# EAGLE design POV_RGB (EAGLE 7.2.0)
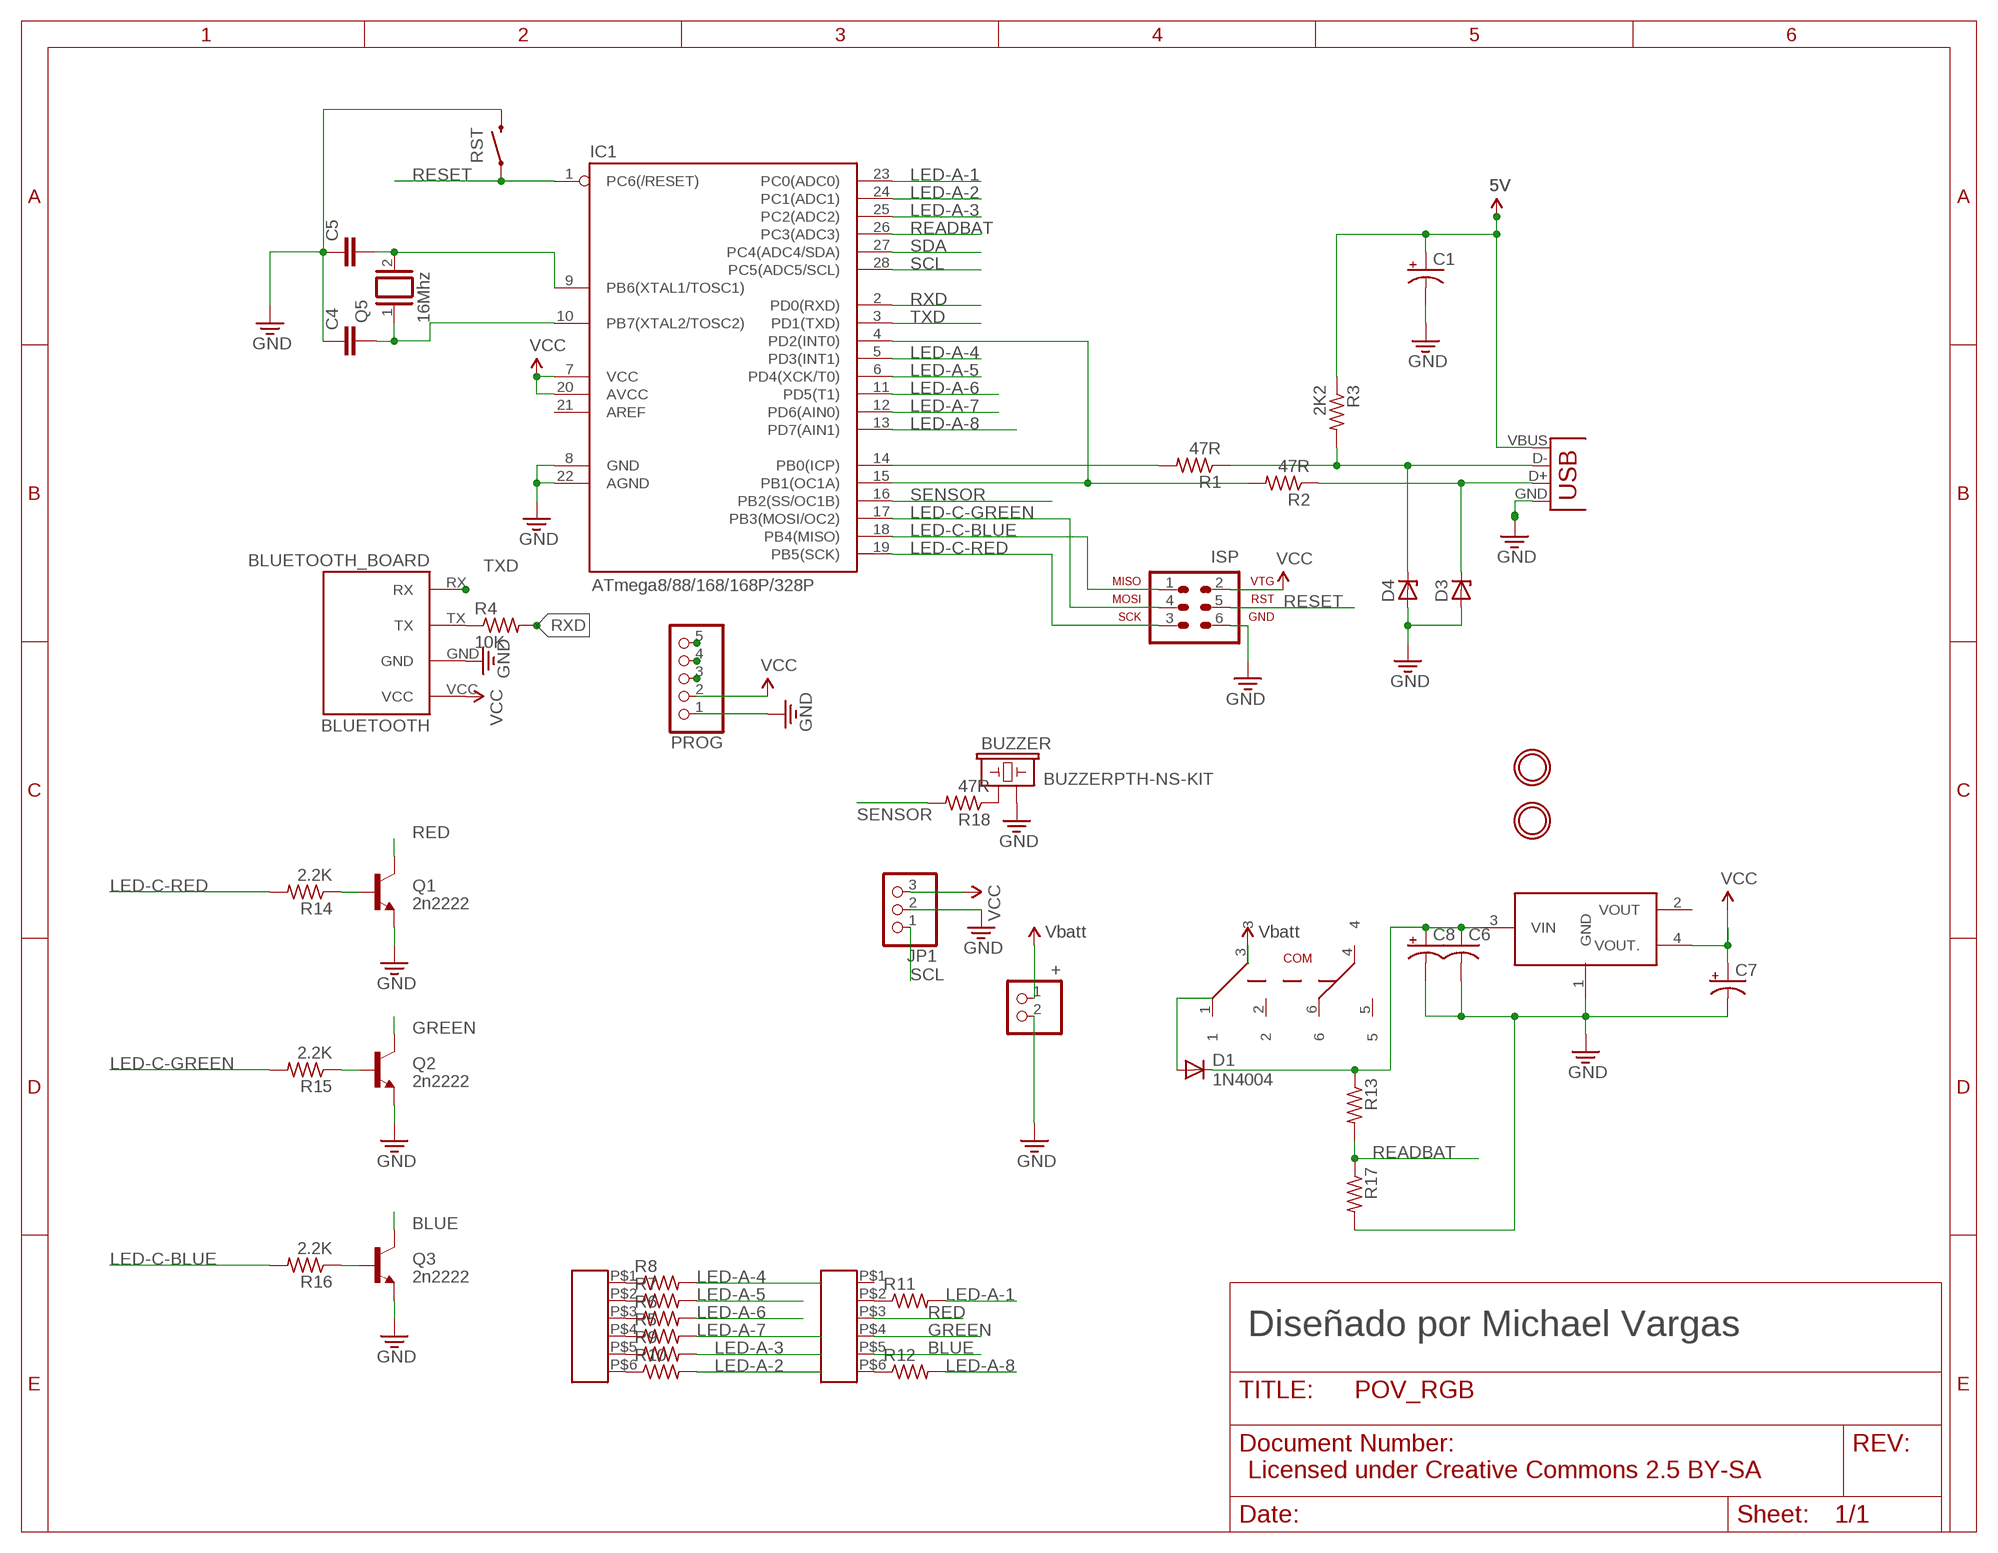
[diagram p0: schematic, sheet 1]

## Parts
5V  LD1117S50TR  [SOT223]
+  HEADER-1X2  [1X02_OVAL]
BLUETOOTH  BLUETOOTH_BOARD  [BT_BOARD_FOOTPRINT]
BUZZER  BUZZERPTH-NS-KIT  [BUZZER-12MM-NS-KIT]
C1  CPOL-USD  [PANASONIC_D]
C4  CAPPTH2  [CAP-PTH-SMALL2]
C5  CAPPTH2  [CAP-PTH-SMALL2]
C6  C-USC1206  [C1206]
C7  CPOL-USD  [PANASONIC_D]
C8  CPOL-USD  [PANASONIC_D]
D1  1N4004  [DO41-10]
D3  ZENER-DIODEDO34-7  [DO34Z7]
D4  ZENER-DIODEDO34-7  [DO34Z7]
IC1  ATmega8/88/168/168P/328P  AVR-MEGA8-PPTH  [DIL28-3]
ISP  AVR-ISP-6  [AVR-ISP-6]
JP1  PINHD-1X3  [1X03]
PROG  PINHD-1X5  [1X05]
Q1  2n2222  TRANSISTOR_NPNTO-92-AMMO  [TO-92-AMMO]
Q2  2n2222  TRANSISTOR_NPNTO-92-AMMO  [TO-92-AMMO]
Q3  2n2222  TRANSISTOR_NPNTO-92-AMMO  [TO-92-AMMO]
Q5  16Mhz  XTAL/S  [QS]
R1  47R  R-US_0207/9  [0207/9]
R2  47R  R-US_0207/9  [0207/9]
R3  2K2  R-US_0207/9  [0207/9]
R4  10K  R-US_R0805  [R0805]
R5  R-US_R0805  [R0805]
R6  R-US_R0805  [R0805]
R7  R-US_R0805  [R0805]
R8  R-US_R0805  [R0805]
R9  R-US_R0805  [R0805]
R10  R-US_R0805  [R0805]
R11  R-US_R0805  [R0805]
R12  R-US_R0805  [R0805]
R13  R-US_R0805  [R0805]
R14  2.2K  R-US_R0805  [R0805]
R15  2.2K  R-US_R0805  [R0805]
R16  2.2K  R-US_R0805  [R0805]
R17  R-US_R0805  [R0805]
R18  47R  R-US_R0805  [R0805]
RST  SWITCH-MOMENTARY-2SMD-1101NE  [TACTILE-SWITCH-1101NE]
U$2  MOUNTINGHOLE2.5_THICK  [MOUNTINGHOLE_2.5_PLATED_THICK]
U$3  SMD_HEADER6  [SMD_HEADER6]
U$4  MOUNTINGHOLE2.5_THICK  [MOUNTINGHOLE_2.5_PLATED_THICK]
U$5  SMD_HEADER6  [SMD_HEADER6]
U$6  TL2285  [TL2285]
USB  USBPTH  [USB-B-PTH]

## Nets
3.3V: +.1 U$6.3 ; supply symbol labelled Vbatt
5V: C1.+ R3.1 USB.VBUS
BLUE: Q3.3(C) U$5.P$5
GND: 5V.1(GND) +.2 BLUETOOTH.GND BUZZER.- C1.- C4.1 C5.1 C6.2 C7.- C8.- D3.A D4.A IC1.8(GND) IC1.22(AGND) ISP.6(GND) JP1.2 PROG.1 Q1.1(E) Q2.1(E) Q3.1(E) R17.2 RST.2 USB.GND USB.S1 USB.S2
GREEN: Q2.3(C) U$5.P$4
LED-A-1: IC1.23(PC0(ADC0)) R11.2
LED-A-2: IC1.24(PC1(ADC1)) R10.2
LED-A-3: IC1.25(PC2(ADC2)) R9.2
LED-A-4: IC1.5(PD3(INT1)) R8.2
LED-A-5: IC1.6(PD4(XCK/T0)) R7.2
LED-A-6: IC1.11(PD5(T1)) R6.2
LED-A-7: IC1.12(PD6(AIN0)) R5.2
LED-A-8: IC1.13(PD7(AIN1)) R12.2
LED-C-BLUE: IC1.18(PB4(MISO)) ISP.1(MISO) R16.2
LED-C-GREEN: IC1.17(PB3(MOSI/OC2)) ISP.4(MOSI) R15.2
LED-C-RED: IC1.19(PB5(SCK)) ISP.3(SCK) R14.2
N$1: R5.1 U$3.P$4
N$2: 5V.3(VIN) C6.1 C8.+ D1.C R13.1
N$3: D4.C R1.1 R3.2 USB.D-
N$4: D3.C R2.1 USB.D+
N$5: R6.1 U$3.P$3
N$6: R7.1 U$3.P$2
N$7: IC1.14(PB0(ICP)) R1.2
N$8: IC1.4(PD2(INT0)) IC1.15(PB1(OC1A)) R2.2
N$9: C5.2 IC1.9(PB6(XTAL1/TOSC1)) Q5.2
N$10: R8.1 U$3.P$1
N$11: R9.1 U$3.P$5
N$12: R10.1 U$3.P$6
N$13: R11.1 U$5.P$2
N$14: R12.1 U$5.P$6
N$15: BUZZER.+ R18.1
N$19: Q1.2(B) R14.1
N$20: Q2.2(B) R15.1
N$21: Q3.2(B) R16.1
N$22: C4.2 IC1.10(PB7(XTAL2/TOSC2)) Q5.1
N$23: D1.A U$6.1
N$24: BLUETOOTH.TX R4.1
READBAT: IC1.26(PC3(ADC3)) R13.2 R17.1
RED: Q1.3(C) U$5.P$3
RESET: IC1.1(PC6(/RESET)) ISP.5(RST) PROG.5 RST.1
RXD: IC1.2(PD0(RXD)) PROG.4 R4.2
SCL: IC1.28(PC5(ADC5/SCL)) JP1.1
SDA: IC1.27(PC4(ADC4/SDA))
SENSOR: IC1.16(PB2(SS/OC1B)) R18.2
TXD: BLUETOOTH.RX IC1.3(PD1(TXD)) PROG.3
VCC: 5V.4(VOUT.) BLUETOOTH.VCC C7.+ IC1.7(VCC) IC1.20(AVCC) ISP.2(VTG) JP1.3 PROG.2
Unconnected: 5V.2(VOUT) IC1.21(AREF) U$5.P$1 U$6.2 U$6.4 U$6.5 U$6.6

## Notes on the sheet
- Diseñado por Michael Vargas
- Licensed under Creative Commons 2.5 BY-SA

## Library data of the parts
5V = v-reg:LD1117S50TR
+ = microbuilder:HEADER-1X2: PIN HEADER
BLUETOOTH = HC-05:BLUETOOTH_BOARD: Bluetooth Board V1.05
BUZZER = SparkFun-Electromechanical:BUZZER: Buzzer 12mm Spark Fun Electronics SKU : Comp-Buzzer; PROD_ID: COMP-08253
C1 C7 C8 = adafruit:CPOL-US: POLARIZED CAPACITOR, American symbol
C4 C5 = SparkFun-Passives:CAP: Capacitor Standard 0603 ceramic capacitor, and 0.1" leaded capacitor.
C6 = adafruit:C-US: CAPACITOR, American symbol
D1 = adafruit:1N4004: DIODE General purpose 1N400x type rectifier (With bigger pads) http://www.ladyada.net/library/pcb/eaglelibrary.html
D3 D4 = diode:ZENER-DIODE: Z-Diode
IC1 = minipov4:AVR-MEGA8-P: MICROCONTROLLER 8 Kbytes FLASH 1 kbytes SRAM 512 bytes EEPROM USART 4-channel 10 bit ADC 2-channel 8 bit ADC
ISP = minipov4:AVR-ISP-6: AVR ISP-6 Serial Programming Header
JP1 = pinhead:PINHD-1X3: PIN HEADER
PROG = pinhead:PINHD-1X5: PIN HEADER
Q1-Q3 = SparkFun-DiscreteSemi:TRANSISTOR_NPN: Generic NPN BJT MMBT2222A - TRANS-08049 (SOT-23, 1A 40V) MPSA42 - TRANS-09116 (SOT-23, 500mA 300V) MMBT5088LT1G - TRANS-11160 (SOT-23, 50 mA 30V) BC547 - COM-08928 <http://www.sparkfun.com/products/8928> (TO-92 45V 100mA) (1.Collector 2.Base 3.Emitter) 2N3904 - COM-00521 <http://www.sparkfun.com/products/521> (TO-92 40V 200mA) (1.Emitter 2.Base 3.Collector) P2N2222A - COM-12852 <http://www.sparkfun.com/products/12852> (TO-92 40V 600mA) (1.Collector 2.Base 3.Emitter)
Q5 = special:XTAL/S: CRYSTAL
R1-R3 = adafruit:R-US_: RESISTOR, American symbol
R4-R18 = resistor:R-US_: RESISTOR, American symbol
RST = SparkFun-Electromechanical:SWITCH-MOMENTARY-2: Various NO switches- pushbuttons, reed, etc; PROD_ID: SWCH-00815
U$2 U$4 = microbuilder:MOUNTINGHOLE: Mounting Hole For #2 screws (0.086"/2.18mm width, 0.094"/2.4mm hole) use 2.5mm
U$3 U$5 = SMD_HEADER10:SMD_HEADER6
U$6 = E-SWITCH_6PIN:TL2285
USB = minipov4:USB: USB Connectors USB-B-PTH is fully proven SKU : PRT-00139 USB-miniB is fully proven SKU : PRT-00587 USB-A-PCB is untested. USB-A-H is throughly reviewed, but untested. Spark Fun Electronics SKU : PRT-00437 USB-B-SMT is throughly reviewed, but untested. Needs silkscreen touching up. USB-A-S has not been used/tested USB-MB-H has not been used/tested

## Board
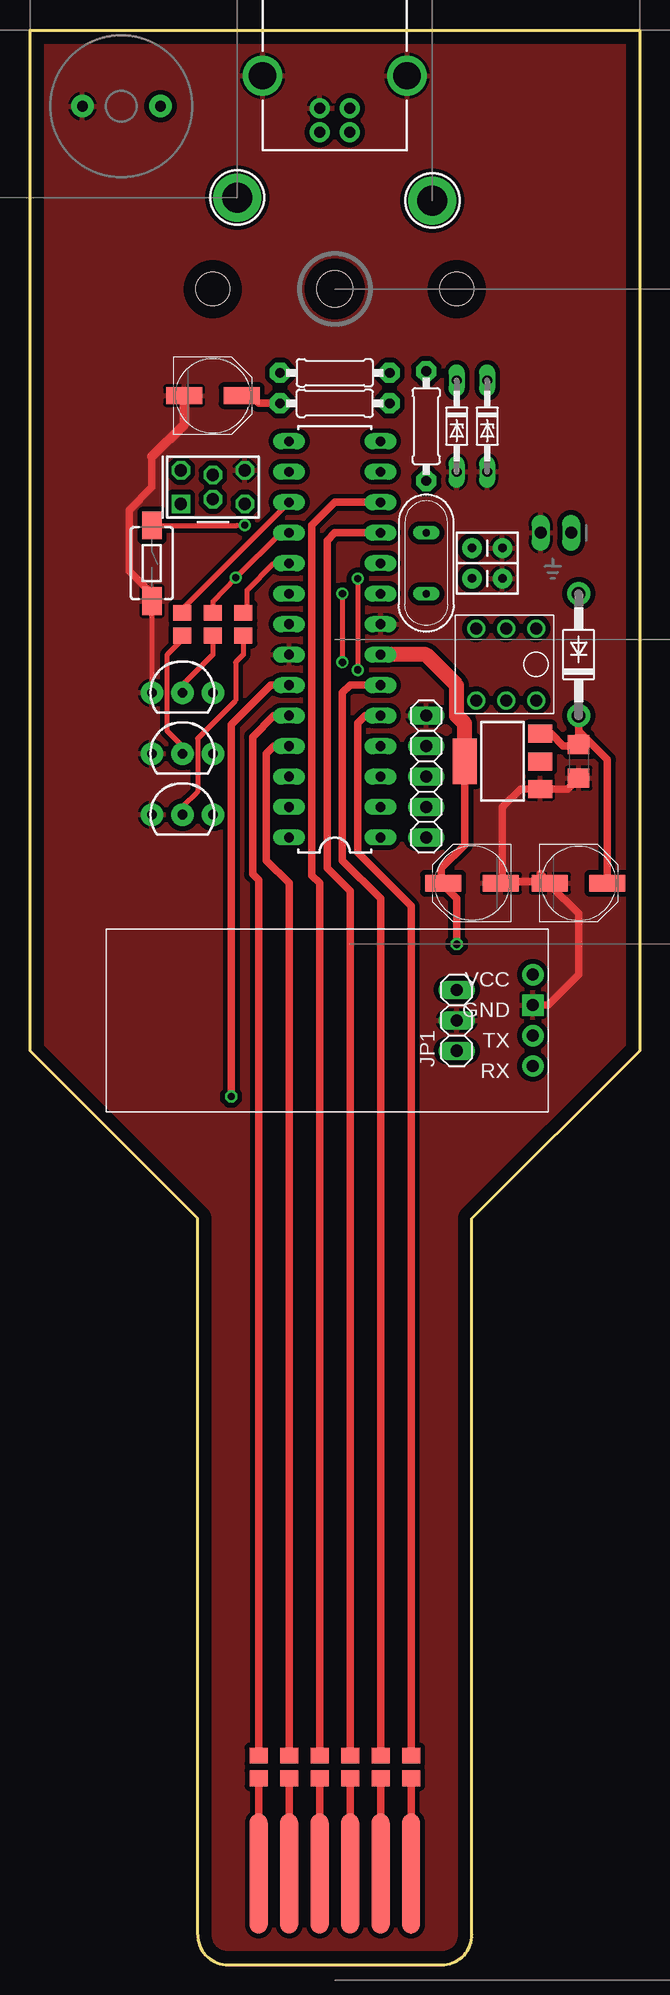
[diagram p1: board, top side]
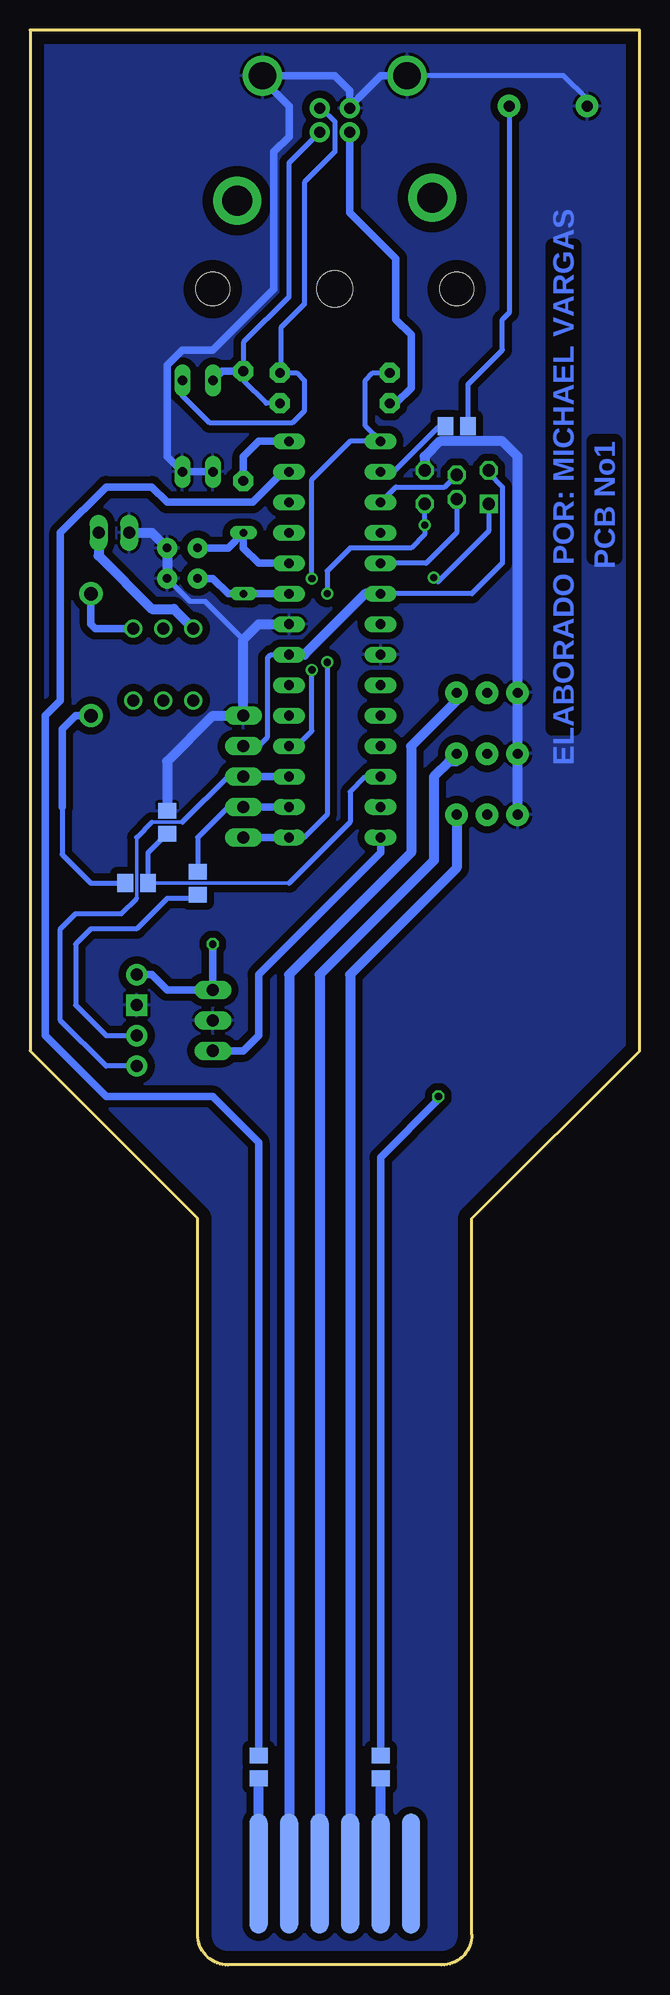
[diagram p2: board, bottom side, seen from below]

Size 50.8 x 161.29 mm. Coordinates in mm from the lower left corner, seen from the top.
Outline: 36.83,2.54 36.83,62.23 50.8,76.2 50.8,161.29 0,161.29 0,76.2 13.97,62.23 13.97,2.54 arc90 16.51,0 34.29,0 arc90 36.83,2.54
Copper layers (1*16): Top 0.035mm / dielectric 1.5mm / Bottom 0.035mm
Design rules "default": minimum track width 10mil, minimum drill 24mil, track to track 8mil, track to pad 8mil, pad to pad 8mil, via to via 8mil, smd to smd 8mil, copper to edge 40mil, drill to drill 8mil, minimum pad ring 10mil, minimum via ring 8mil, stop-mask expansion 4mil, vias tented up to drill 0mil, thermal gap 10mil
Holes 3 mm at 25.4,139.7
Holes 2.8 mm at 15.24,139.7 35.56,139.7

### Footprints (pad centres in the part's own frame; a part is rotated, then mirrored left to right if it is on the bottom)
SOT223 = smd 1.5 x 2: 1 -2.3,-3.15; 2 0,-3.15; 3 2.3,-3.15 | smd 3.8 x 2: 4 0,3.15
1X02_OVAL = drill 1 long: 1 -1.27,0; 2 1.27,0
BT_BOARD_FOOTPRINT = drill 1 pad 1.778 square: GND -16.51,-1.27 | drill 1 pad 1.778: RX -16.51,3.81; TX -16.51,1.27; VCC -16.51,-3.81
BUZZER-12MM-NS-KIT = drill 0.9 pad 1.88: + 3.25,0; - -3.25,0
PANASONIC_D = smd 3 x 1.4: + 2.4,0; - -2.4,0
CAP-PTH-SMALL2 = drill 0.7 pad 1.651: 1 0,0; 2 2.54,0
C1206 = smd 1.6 x 1.8: 1 -1.4,0; 2 1.4,0
DO41-10 = drill 1.118 pad 1.93: A 5.08,0; C -5.08,0
DO34Z7 = drill 0.813 long: A 3.81,0; C -3.81,0
DIL28-3 = drill 0.813 long: 1 -16.51,-3.81; 2 -13.97,-3.81; 3 -11.43,-3.81; 4 -8.89,-3.81; 5 -6.35,-3.81; 6 -3.81,-3.81; 7 -1.27,-3.81; 8 1.27,-3.81; 9 3.81,-3.81; 10 6.35,-3.81; 11 8.89,-3.81; 12 11.43,-3.81; 13 13.97,-3.81; 14 16.51,-3.81; 15 16.51,3.81; 16 13.97,3.81; 17 11.43,3.81; 18 8.89,3.81; 19 6.35,3.81; 20 3.81,3.81; 21 1.27,3.81; 22 -1.27,3.81; 23 -3.81,3.81; 24 -6.35,3.81; 25 -8.89,3.81; 26 -11.43,3.81; 27 -13.97,3.81; 28 -16.51,3.81
AVR-ISP-6 = drill 1.016 square: 1 -2.667,-1.397 | drill 1.016 octagon: 2 -2.667,1.397; 3 0,-1.016; 4 0,1.016; 5 2.667,-1.397; 6 2.667,1.397
1X03 = drill 1.016 long: 1 -2.54,0; 2 0,0; 3 2.54,0
1X05 = drill 1.016 long: 1 -5.08,0; 2 -2.54,0; 3 0,0; 4 2.54,0; 5 5.08,0
TO-92-AMMO = drill 0.813 pad 1.88: 1 -2.54,0; 2 0,0; 3 2.54,0
QS = drill 0.61 long: 1 -2.54,0; 2 2.54,0
0207/9 = drill 0.813 pad 1.676 octagon: 1 -4.572,0; 2 4.572,0
R0805 = smd 1.3 x 1.5: 1 -0.95,0; 2 0.95,0
TACTILE-SWITCH-1101NE = smd 2.3 x 1.6: 1 -3.15,0; 2 3.15,0
MOUNTINGHOLE_2.5_PLATED_THICK = drill 2.5 pad 4: P$1 0,0
SMD_HEADER6 = smd 1.5 x 10: P$1 -6.35,0; P$2 -3.81,0; P$3 -1.27,0; P$4 1.27,0; P$5 3.81,0; P$6 6.35,0
TL2285 = drill 1: 1 -6,-1; 2 -6,-3.5; 3 -6,-6; 4 0,-1; 5 0,-3.5; 6 0,-6
USB-B-PTH = drill 0.914 pad 1.676: D+ 2.7,1.25; D- 4.71,1.25; GND 2.7,-1.25; VBUS 4.71,-1.25 | drill 2.286: S1 0,-6.02; S2 0,6.02

### Placement (x,y rotation side)
5V  39.37,100.33 90 top
+  43.81,119.38 180 top
BLUETOOTH  25.4,78.74 180 top
BUZZER  7.62,154.94 0 top
C1  15.24,130.81 0 top
C4  39.37,118.11 180 top
C5  39.37,115.57 180 top
C6  45.72,100.33 270 top
C7  36.83,90.17 180 top
C8  45.72,90.17 0 top
D1  45.72,109.22 90 top
D3  38.1,128.27 270 top
D4  35.56,128.27 270 top
IC1  25.4,110.49 90 top
ISP  15.24,123.19 0 top
JP1  35.56,78.74 90 top
PROG  33.02,99.06 270 top
Q1  12.7,95.88 0 top
Q2  12.7,100.96 0 top
Q3  12.7,106.04 0 top
Q5  33.02,116.84 270 top
R1  33.02,128.27 270 top
R2  25.4,132.71 180 top
R3  25.4,130.17 0 top
R4  36.83,90.17 90 bottom
R5  24.13,16.51 90 top
R6  26.67,16.51 90 top
R7  29.21,16.51 90 top
R8  31.75,16.51 90 top
R9  21.59,16.51 90 top
R10  19.05,16.51 90 top
R11  21.59,16.51 90 bottom
R12  31.75,16.51 90 bottom
R13  41.91,90.17 0 bottom
R14  17.78,111.76 90 top
R15  12.7,111.76 90 top
R16  15.24,111.76 90 top
R17  39.37,95.25 90 bottom
R18  15.24,128.27 180 bottom
RST  10.16,116.84 270 top
U$2  33.53,147.07 0 top
U$3  25.4,7.62 180 top
U$4  17.27,147.32 0 top
U$5  25.4,7.62 180 bottom
U$6  43.18,105.41 270 top
USB  25.4,157.48 270 top

### Tracks (layer width: path | path; a pad name or v marks a point on that pad's centre or on a via)
3.3V
  Bottom 0.813: +.1 45.08,117.47 40.64,113.03 38.8,113.03 U$6.3
5V
  Top 0.61: C1.+ 18.41,130.81 19.05,130.17 R3.1
  Bottom 0.61: USB.VBUS 24.15,146.07 20.32,142.24 20.32,137.16 19.05,135.89 19.05,131.44 20.32,130.17 R3.1
BLUE
  Bottom 0.813: Q3.3 15.24,105.41 19.05,101.6 19.05,92.71 29.21,82.55 U$5.P$5
GND
  Top 0.406: RST.2 10.16,113.03 Q3.1 | 39.37,90.03 C7.-
  Top 0.61: 10.16,125.73 10.16,123.19 8.25,121.28 8.25,116.2 10.16,114.3 10.16,113.03 | 42.52,90.97 C8.- | C6.2 44.82,98.03 5V.1 40.88,98.03 39.37,96.52 39.37,90.31 | 39.37,90.31 C7.- | 39.37,90.31 43.18,90.31 C8.- | C8.- 43.32,90.03 45.72,87.63 45.72,82.55 43.18,80.01 BLUETOOTH.GND
  Top 0.813: C1.- 12.84,128.41 10.16,125.73
  Bottom 0.406: 33.02,110.49 36.2,113.66 37.46,113.66 C5.1 | 17.91,125.73 17.78,125.73 | BUZZER.- 4.37,155.5 6.35,157.48 USB.S1
  Bottom 0.61: D4.A D3.A 39.37,125.73 39.37,133.35 38.1,134.62 35.56,134.62 30.48,139.7 30.48,151.13 29.21,152.4 29.21,154.94 31.11,156.84 | USB.S2 31.42,157.15 31.11,156.84 | USB.S1 21.59,157.48 24.13,154.94 24.13,154.8 USB.GND 24.15,156.23 25.4,157.48 30.48,157.48 31.11,156.84 | 41.91,119.38 +.2
  Bottom 0.813: Q1.1 Q2.1 Q3.1 10.16,125.73 11.43,127 16.64,127 17.91,125.73 ISP.6 17.78,124.46 | IC1.8 31.75,111.76 33.02,110.49 PROG.1 35.56,104.14 39.37,100.33 R17.2 | 41.91,119.38 40.64,119.38 C4.1 C5.1
  pour Bottom (isolate 0.61): -1.27,0 0,162.56 52.07,162.56 52.07,1.27
  pour Top (isolate 0.406): 50.8,0 0,0 0,161.29 50.8,161.29
GREEN
  Bottom 0.813: Q2.3 15.24,100.33 15.87,100.33 17.14,99.06 17.14,92.07 26.67,82.55 U$5.P$4 26.67,6.35
LED-A-1  (via drill 0.6)
  Top 0.61: IC1.23 20.07,106.68 16.76,103.38 v16.76,72.39
  Bottom 0.61: v16.76,72.39 16.76,72.14 21.59,67.31 R11.2
LED-A-2
  Top 0.61: R10.2 19.05,90.42 18.54,90.93 18.54,102.36 20.32,104.14 IC1.24
LED-A-3
  Top 0.61: IC1.25 20.32,101.6 19.68,100.96 19.68,92.07 21.59,90.17 R9.2
LED-A-4
  Top 0.61: IC1.5 27.94,104.14 27.3,103.5 27.3,92.71 31.75,88.26 R8.2
LED-A-5
  Top 0.61: IC1.6 26.67,106.68 26.04,106.04 26.04,92.07 29.21,88.9 R7.2
LED-A-6
  Top 0.61: IC1.11 25.4,119.38 24.76,118.74 24.76,91.44 26.67,89.53 R6.2
LED-A-7
  Top 0.61: IC1.12 25.4,121.92 23.49,120.01 23.49,90.8 24.13,90.17 R5.2
LED-A-8
  Bottom 0.61: IC1.13 29.46,124.21 29.97,124.21 32.26,121.92 39.37,121.92 40.64,123.19 44.45,123.19 48.26,119.38 48.26,105.41 49.53,104.14 49.53,77.47 44.45,72.39 35.56,72.39 31.75,68.58 R12.2
LED-C-BLUE  (via drill 0.6)
  Top 0.406: IC1.18 20.95,119.38 v17.14,115.64 15.24,113.66 R16.2
  Bottom 0.406: ISP.1 12.57,119.51 16.51,115.57 16.52,115.57 16.8,115.29 16.8,115.3 v17.14,115.64
LED-C-GREEN
  Top 0.406: IC1.17 12.7,113.03 R15.2
  Bottom 0.406: IC1.17 20.32,123.19 16.26,123.19 ISP.4
LED-C-RED
  Top 0.406: R14.2 18.09,112.71 18.09,114.61 20.32,116.84 IC1.19
  Bottom 0.406: ISP.3 15.24,119.38 17.78,116.84 IC1.19
N$1
  Top 0.61: R5.1 U$3.P$4
N$2
  Top 0.61: 5V.3 43.42,102.63 44.45,101.6 45.59,101.6 C6.1 45.72,102.87 | D1.C 45.72,102.87 | C8.+ 48.12,100.47 45.72,102.87
  Bottom 0.406: 48.12,96.52 48.12,92.57 45.72,90.17 R13.1
  Bottom 0.61: 48.12,96.52 48.12,103.01 46.99,104.14 D1.C
N$3
  Bottom 0.406: USB.D- 29.21,150.21 29.21,139.06 33.02,135.25 R1.1 33.02,132.08 31.11,130.17 R3.2
  Bottom 0.61: R1.1 34.8,132.84 D4.C
N$4
  Bottom 0.406: USB.D+ 26.51,154.78 25.4,153.67 25.4,151.13 27.94,148.59 27.94,138.43 29.84,136.52 29.84,132.21 R2.1 28.57,132.71 27.94,132.08 27.94,129.54 28.96,128.52 35.81,128.52 38.1,130.81 D3.C
N$5
  Top 0.61: R6.1 U$3.P$3
N$6
  Top 0.61: R7.1 U$3.P$2
N$7
  Bottom 0.61: R1.2 33.02,125.73 31.75,127 IC1.14
N$8  (via drill 0.6)
  Top 0.406: v27.3,115.57 v27.3,107.95
  Bottom 0.406: R2.2 22.22,132.71 22.86,132.08 22.86,128.27 IC1.15 24.13,127 27.3,123.82 v27.3,115.57 | IC1.4 28.57,101.6 27.3,102.87 v27.3,107.95
N$9
  Bottom 0.61: IC1.9 Q5.2 34.29,114.3 35.56,115.57 C5.2
N$10
  Top 0.61: U$3.P$1 R8.1
N$11
  Top 0.61: R9.1 U$3.P$5
N$12
  Top 0.61: U$3.P$6 R10.1
N$13
  Bottom 0.813: U$5.P$2 R11.1
N$14
  Bottom 0.813: U$5.P$6 R12.1
N$15
  Bottom 0.406: R18.1 14.29,131.76 11.43,134.62 11.43,137.16 10.87,137.72 BUZZER.+
N$19
  Top 0.406: R14.1 17.78,109.22 17.14,108.58 17.14,105.41 13.97,102.23 13.97,97.79 12.7,96.52 Q1.2
N$20
  Top 0.406: R15.1 12.7,110.49 11.43,109.22 11.43,102.87 12.7,101.6 Q2.2
N$21
  Top 0.406: R16.1 15.24,109.22 12.7,106.68 Q3.2
N$22
  Bottom 0.61: IC1.10 31.75,116.84 33.02,118.11 Q5.1 34.29,118.11 C4.2
N$23
  Bottom 0.61: U$6.1 45.37,111.41 45.72,111.76 D1.A
N$24
  Bottom 0.406: R4.1 36.83,88.9 39.37,88.9 41.91,86.36 45.72,86.36 46.99,85.09 46.99,80.01 44.45,77.47 BLUETOOTH.TX
READBAT
  Bottom 0.305: 29.21,90.17 R13.2
  Bottom 0.406: IC1.26 22.86,99.06 24.13,97.79 24.13,95.25 29.21,90.17 | R13.2 40.96,92.71 R17.1
RED
  Bottom 0.813: Q1.3 15.24,91.44 24.13,82.55 U$5.P$3
RESET  (via drill 0.6)
  Top 0.406: v26.04,114.3 v26.04,108.58 | RST.1 17.25,119.99 v17.91,120.01
  Bottom 0.406: IC1.1 27.94,93.98 26.04,95.88 v26.04,108.58 | ISP.5 v17.91,120.01 17.91,119.25 19.05,118.11 24.13,118.11 26.04,116.2 v26.04,114.3
  Bottom 0.61: PROG.5 IC1.1
RXD
  Bottom 0.406: PROG.4 34.29,96.52 36.83,93.98 R4.2
  Bottom 0.61: IC1.2 PROG.4
SCL
  Bottom 0.61: IC1.28 21.59,92.71 31.75,82.55 31.75,77.47 33.02,76.2 JP1.1
SENSOR
  Bottom 0.406: IC1.16 20.5,124.46 16.78,128.17 16.29,128.17 R18.2
TXD
  Bottom 0.305: 38.1,95.25 40.64,95.25 | 41.91,93.98 41.91,88.9
  Bottom 0.406: PROG.3 34.29,99.06 38.1,95.25 | 40.64,95.25 41.91,93.98 | BLUETOOTH.RX 44.45,74.93 48.26,78.74 48.26,86.36 46.99,87.63 43.18,87.63 41.91,88.9
  Bottom 0.61: PROG.3 IC1.3
VCC  (via drill 0.6)
  Top 0.61: 5V.4 36.22,93.37 34.29,91.44 34.29,90.31 C7.+ 34.29,90.17 35.56,88.9 v35.56,85.09
  Top 1.27: 5V.4 36.22,103.48 35.56,104.14 35.56,106.68 33.02,109.22 IC1.7
  Bottom 0.406: ISP.2 12.57,124.33 11.43,123.19 11.43,116.84 13.97,114.3 IC1.20 | 31.75,101.6 30.99,102.36 30.99,108.97 30.73,109.22 28.45,109.22
  Bottom 0.61: PROG.2 31.75,101.6 | v35.56,85.09 JP1.3 39.37,81.28 40.64,82.55 BLUETOOTH.VCC
  Bottom 0.813: IC1.20 22.86,114.3 27.94,109.22 28.45,109.22 IC1.7

### Text on the board
Bottom: PCB No1 | ELABORADO POR: MICHAEL VARGAS
tDocu: V-USB | ROTOR | 100uF | 1 | DISPLAY POV CON LED'S RGB | PROYECTO DE GRADO / TEC. PROFESIONAL EN ELECTRONICA / 2015 | ATMEGA328P | 100uF | MICHAEL VARGAS